# Altium schematic sheet Sheet4.SchDoc
size A4
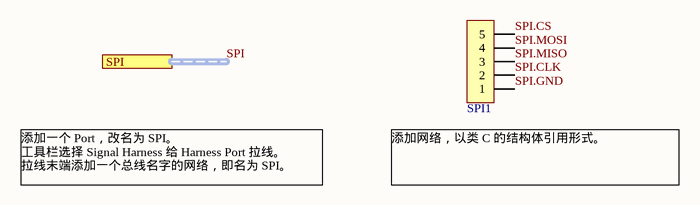
[diagram p0: Sheet4.SchDoc]

## Parts
SPI1  HDR-1X5  [HDR2.54-LI-5P]  (value not drawn)

## Ports
SPI (harness SPI)

## Nets
SPI.CLK: SPI1.2
SPI.CS: SPI1.5
SPI.GND: SPI1.1
SPI.MISO: SPI1.3
SPI.MOSI: SPI1.4

## Buses and harness runs
harness SPI = port SPI

## Notes on the sheet
- 添加一个 Port，改名为 SPI。
  工具栏选择 Signal Harness 给 Harness Port 拉线。
  拉线末端添加一个总线名字的网络，即名为 SPI。
- (near SPI1) 添加网络，以类 C 的结构体引用形式。

## Library data of the parts
SPI1 = Header 5: 5P接插件; 版权归属: 源创客; BOM名称: 5P接插件; 学习资源: www.ooocke.com